# Altium schematic sheet BatteryCharger.SchDoc
size Letter; CompanyName: Penn Electric Racing; Organization: Penn Electric Racing; Address1: 220 S. 33rd St; Address2: Towne Bldg, B11; Address3: Philadelpia, PA 19104; Address4: USA; SheetNumber: 4; SheetTotal: 12
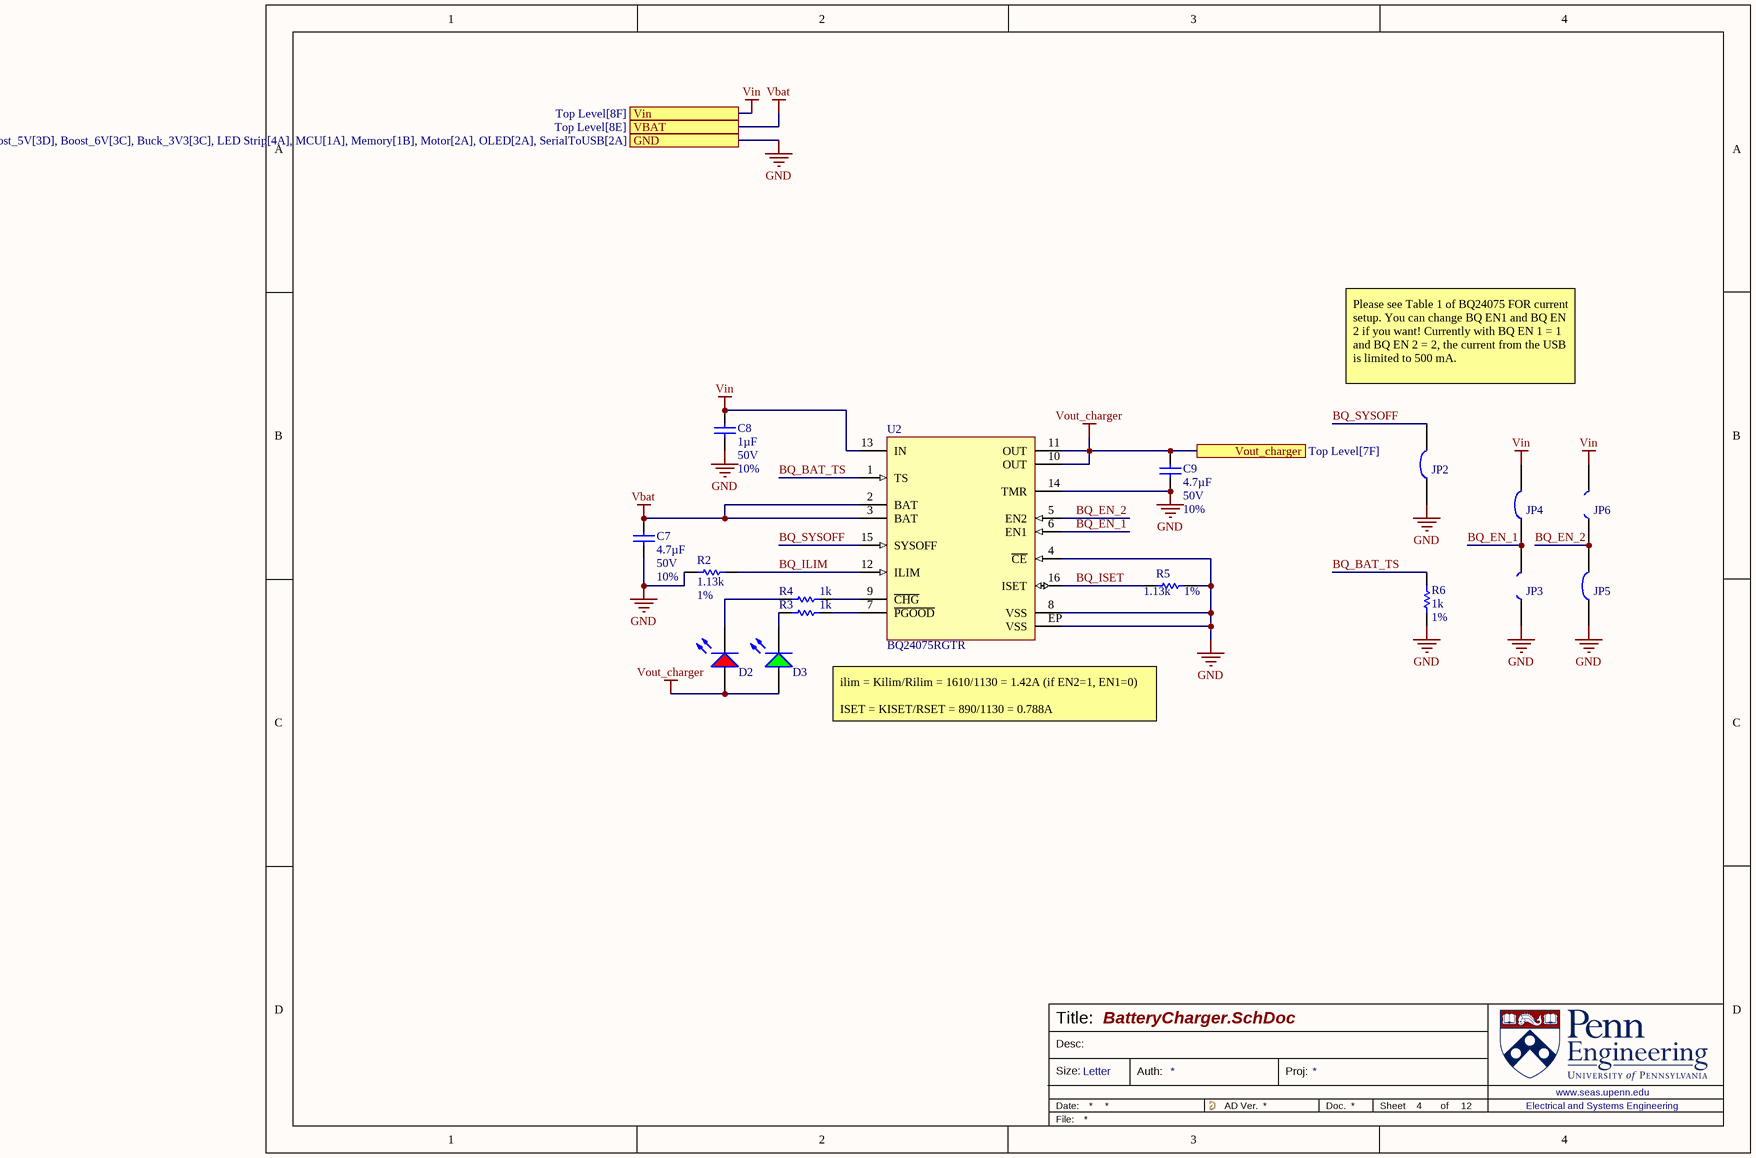
[diagram p0: BatteryCharger.SchDoc]

## Parts
C7  value 4.7µF  Voltage: 50V  Tolerance: 10%  [0805_CAP]  (hidden comment: CAP 0805 4.7UF 50V 10% X5R)
C8  value 1µF  Voltage: 50V  Tolerance: 10%  [0603_CAP]  (hidden comment: CAP 0603 1UF 50V 10% X7R)
C9  value 4.7µF  Voltage: 50V  Tolerance: 10%  [0805_CAP]  (hidden comment: CAP 0805 4.7UF 50V 10% X5R)
D2  LSM0805412V  [LED_0805_RED]  (value not drawn)
D3  LSM0805452V  [LED_0805]  (value not drawn)
JP2  0603 link  [0603_JP_RES]  (value not drawn)
JP3  0603 link (Open)  [0603_JP_Open]  (value not drawn)  (no BOM)
JP4  0603 link  [0603_JP_RES]  (value not drawn)
JP5  0603 link  [0603_JP_RES]  (value not drawn)
JP6  0603 link (Open)  [0603_JP_Open]  (value not drawn)  (no BOM)
R2  value 1.13k  Tolerance: 1%  [0603_RES]  (hidden comment: RES 0603 1.13K 1%)
R3  value 1k  [0603_RES]  (hidden comment: RES 0603 1K 1%)
R4  value 1k  [0603_RES]  (hidden comment: RES 0603 1K 1%)
R5  value 1.13k  Tolerance: 1%  [0603_RES]  (hidden comment: RES 0603 1.13K 1%)
R6  value 1k  Tolerance: 1%  [0603_RES]  (hidden comment: RES 0603 1K 1%)
U2  BQ24075RGTR  [FP-RGT0016C-IPC_A]

## Ports
GND (see Top Level[8E], AI_Audio_Module[4A], Boost_5V[3D], Boost_6V[3C], Buck_3V3[3C], LED Strip[4A], MCU[1A], Memory[1B], Motor[2A], OLED[2A], SerialToUSB[2A]), VBAT (see Top Level[8E]), Vin (see Top Level[8F]), Vout_charger (see Top Level[7F])

## Nets
GND: C7.1 C8.1 C9.1 JP2.1 JP3.1 JP5.2 R2.1 R5.2 R6.1 U2.4(~{CE}) U2.8(VSS) U2.14(TMR) U2.EP(VSS) ; port GND
Vbat: C7.2 U2.2(BAT) U2.3(BAT) ; port VBAT
Vin: C8.2 JP4.2 JP6.1 U2.13(IN) ; port Vin
Vout_charger: C9.2 D2.A D3.A U2.10(OUT) U2.11(OUT) ; port Vout_charger
BQ_BAT_TS: R6.2 U2.1(TS)
BQ_EN_1: JP3.2 JP4.1 U2.6(EN1)
BQ_EN_2: JP5.1 JP6.2 U2.5(EN2)
BQ_ILIM: R2.2 U2.12(ILIM)
BQ_ISET: R5.1 U2.16(ISET)
BQ_SYSOFF: JP2.2 U2.15(SYSOFF)
NetD2_K: D2.K R4.2
NetD3_K: D3.K R3.2
NetR3_1: R3.1 U2.7(~{PGOOD})
NetR4_1: R4.1 U2.9(~{CHG})

## Notes on the sheet
- Please see Table 1 of BQ24075 FOR current setup. You can change BQ EN1 and BQ EN 2 if you want! Currently with BQ EN 1 = 1 and BQ EN 2 = 2, the current from the USB is limited to 500 mA.
- ilim = Kilim/Rilim = 1610/1130 = 1.42A (if EN2=1, EN1=0)
  ISET = KISET/RSET = 890/1130 = 0.788A
- Title:
- Desc:
- Size:
- Letter
- Auth:
- Proj:
- Sheet
- of
- www.seas.upenn.edu
- Electrical and Systems Engineering

## Library data of the parts
C7 C9 = CMP-001-00021-2: Capacitor Surface Mount 0805 Footprint 4.7UF 50V 10% Tolerance Ceramic X5R; P/N: CAP 0805 4.7UF 35V 10% X5R; Description in Visual: Cap SMT 0805 4.7UF 35V 10%  Cer X5R; PCB Package: 0805; RoHS: Yes; Type: Ceramic X5R; Mount: SMT; Capacitor Type: Ceramic; Pins: 2; Case/Package: 0805
C8 = CMP-011-000287-2: Capacitor Surface Mount 0603 Footprint 1UF 50V 10% Tolerance Ceramic X7R; Manufacturer: Various; Description in Visual: Cap SMT 0603 1UF 50V 10% Ceramic X7R; PCB Package: 0603; Manufacturer P/N: CAP 0603 1UF 50V 10% X7R; P/N: CAP 0603 1UF 50V 10% X7R; Type: Ceramic X7R; Mount: SMT; Capacitor Type: Ceramic; Case/Package: 0603; RoHS: Yes
D2 = CMP-00026-00001-2: Single Color LED, RED, 0805; Test Current: 20mA; Forward Voltage: 2V; Wavelength - Peak: 625nm; RoHS Compliant: Yes; Current: 20mA; Color: Red; Wavelength - Dominant: 625nm
D3 = CMP-00038-4: Single Color LED, Green, 0805; Test Current: 20mA; Forward Voltage: 2V; Wavelength - Peak: 571nm; Package (Case): 0805; RoHS Compliant: Yes; Current: 20mA; Wavelength - Dominant: 571nm; Color: Green
JP2 JP4 JP5 = CMP-00422-5: 0O link, SMD, 0603, Solder Bridge Option; Manufacturer P/N: Various; Manufacturer: Generic; Description in Visual: 0O link, Solder Bridge/SMD, Open; Value: 0.025; Source: Shunts and Jumpers.SchLib; Pin Count: 2; Design Item ID: 0603 link; Component Type: Net Tie; P/N: 0603 link
JP3 JP6 = CMP-00423-2: 0O link, Solder Bridge/SMD, Open; Value: 10000000000meg; P/N: 0603 link (Open); Description in Visual: 0O link, Solder Bridge/SMD, Open; Component Type: Standard (No BOM); Design Item ID: 0603 link (Open); Pin Count: 2; Source: Shunts and Jumpers.SchLib
R2 R5 = CMP-005-001984-2: Resistor Surface Mount, 1.13K Ohms, 0603 Footprint, 1% Tolerance 0.1W; Manufacturer: Various; Description in Visual: Res SMT 1.13K 0603  1%  0.1W; PCB Package: 0603; Power Rating: 0.1W; Manufacturer P/N: RES 0603 1.13K 1%; Mount: SMT
R3 R4 R6 = CMP-005-002503-3: Resistor Surface Mount, 1K Ohms, 0603 Footprint, 1% Tolerance 0.1W; Manufacturer: Various; PCB Package: 0603; Description in Visual: Res SMT 1K 0603  1%  0.1W; JLCPCB Part #: C21190; Power Rating: 0.1W; Manufacturer P/N: RES 0603 1K 1%; Mount: SMT
  R3 R4: Tolerance: 1%
U2 = CMP-00080-5: Power Supply Support Circuit, Adjustable, 1 Channel, 6.6, PQCC16; Nominal Supply Voltage: 5V; Channels: 1; Min Supply Voltage: 4.35V; Qualification Status: Not Qualified; Power Supplies: 4.5/6.3V; Package Equivalence Code: LCC16,.12SQ,20; Adjustable Threshold: Yes; Package Body Material: Plastic; Max Supply Voltage: 26V; Supply Current-Max (Isup): 1.5mA; Reach SVHC Compliant: Yes; RoHS Compliant: Yes; Throw Configuration: POWER SUPPLY SUPPORT CIRCUIT; Moisture Sensitivity Level: 2; Min Operating Temperature: -40°C; JESD-609 Code: e4; Width: 3mm; Terminal Form: No Lead; Terminal Finish: Nickel; Terminal Position: QUAD; Height - Seated (Max): 1mm; Temperature Grade: INDUSTRIAL; Case/Package: HVQCCN; Length: 3mm; Max Operating Temperature: 85°C; Peak Reflow Temperature (Cel): 260°C; Number of Channels: 1; Package Shape: Square; Package Style: CHIP CARRIER, HEAT SINK/SLUG, VERY THIN PROFILEMeter; Surface Mount: Yes; Pins: 16; JESD-30 Code: S-PQCC-N16; Terminal Pitch: 0.5mm